# EAGLE design RFID UNIT (EAGLE 9.5.0)
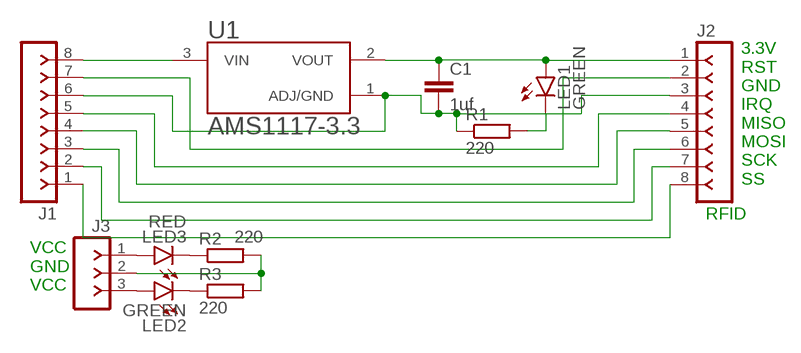
[diagram p0: schematic, sheet 1]

## Parts
C1  1uf  C-EU025-025X050  [C025-025X050]
J1  F-1X08-SIP-100-32Y  [SIP-100-08-32Y]
J2  F-1X08-SIP-100-32Y  [SIP-100-08-32Y]
J3  F-1X03-SIP-100-32Y  [SIP-100-03-32Y]
LED1  GREEN  LEDSML0805  [SML0805]
LED2  GREEN  LED5MM  [LED5MM]
LED3  RED  LED5MM  [LED5MM]
R1  220  R-EU_0204/7  [0204/7]
R2  220  R-EU_0204/7  [0204/7]
R3  220  R-EU_0204/7  [0204/7]
U1  AMS1117-3.3  [SOT229P700X180-4N]

## Nets
N$1: C1.1 J2.1 LED1.A U1.2(VOUT)
N$3: J3.3 LED2.A
N$4: J1.8 U1.3(VIN)
N$5: J1.7 J2.2
N$6: LED3.K(C) R2.1
N$7: LED2.K(C) R3.1
N$8: J1.5 J2.4
N$9: J1.4 J2.5
N$10: J1.3 J2.6
N$11: J1.2 J2.7
N$12: J1.1 J2.8
N$13: J3.1 LED3.A
N$14: C1.2 J1.6 J2.3 R1.1 U1.1(ADJ/GND)
N$15: J3.2 R2.2 R3.2
N$16: LED1.C R1.2

## Notes on the sheet
- 3.3V
  RST
  GND
  IRQ
  MISO
  MOSI
  SCK
  SS
- RFID
- VCC
  GND
  VCC

## Library data of the parts
C1 = rcl:C-EU: CAPACITOR, European symbol; SPICEPREFIX: C
J1 J2 = con-headers-jp:F-1X08-: FEMALE HEADER
J3 = con-headers-jp:F-1X03-: FEMALE HEADER
LED1-LED3 = led:LED: LED OSRAM: - CHIPLED LG R971, LG N971, LY N971, LG Q971, LY Q971, LO R971, LY R971 LH N974, LH R974 LS Q976, LO Q976, LY Q976 LO Q996 - Hyper CHIPLED LW Q18S LB Q993, LB Q99A, LB R99A - SideLED LS A670, LO A670, LY A670, LG A670, LP A670 LB A673, LV A673, LT A673, LW A673 LH A674 LY A675 LS A676, LA A676, LO A676, LY A676, LW A676 LS A679, LY A679, LG A679 - Hyper Micro SIDELED® LS Y876, LA Y876, LO Y876, LY Y876 LT Y87S - SmartLED LW L88C, LW L88S LB L89C, LB L89S, LG L890 LS L89K, LO L89K, LY L89K LS L896, LA L896, LO L896, LY L896 - TOPLED LS T670, LO T670, LY T670, LG T670, LP T670 LSG T670, LSP T670, LSY T670, LOP T670, LYG T670 LG T671, LOG T671, LSG T671 LB T673, LV T673, LT T673, LW T673 LH T674 LS T676, LA T676, LO T676, LY T676, LB T676, LH T676, LSB T676, LW T676 LB T67C, LV T67C, LT T67C, LS T67K, LO T67K, LY T67K, LW E67C LS E67B, LA E67B, LO E67B, LY E67B, LB E67C, LV E67C, LT E67C LW T67C LS T679, LY T679, LG T679 LS T770, LO T770, LY T770, LG T770, LP T770 LB T773, LV T773, LT T773, LW T773 LH T774 LS E675, LA E675, LY E675, LS T675 LS T776, LA T776, LO T776, LY T776, LB T776 LHGB T686 LT T68C, LB T68C - Hyper Mini TOPLED® LB M676 - Mini TOPLED Santana® LG M470 LS M47K, LO M47K, LY M47K Source: http://www.osram.convergy.de LUXEON: - LUMILED® LXK2-PW12-R00, LXK2-PW12-S00, LXK2-PW14-U00, LXK2-PW14-V00 LXK2-PM12-R00, LXK2-PM12-S00, LXK2-PM14-U00 LXK2-PE12-Q00, LXK2-PE12-R00, LXK2-PE12-S00, LXK2-PE14-T00, LXK2-PE14-U00 LXK2-PB12-K00, LXK2-PB12-L00, LXK2-PB12-M00, LXK2-PB14-N00, LXK2-PB14-P00, LXK2-PB14-Q00 LXK2-PR12-L00, LXK2-PR12-M00, LXK2-PR14-Q00, LXK2-PR14-R00 LXK2-PD12-Q00, LXK2-PD12-R00, LXK2-PD12-S00 LXK2-PH12-R00, LXK2-PH12-S00 LXK2-PL12-P00, LXK2-PL12-Q00, LXK2-PL12-R00 Source: www.luxeon.com KINGBRIGHT: KA-3528ASYC Source: www.kingbright.com
R1-R3 = rcl:R-EU_: RESISTOR, European symbol; SPICEPREFIX: R
U1 = AMS1117-3.3:AMS1117-3.3: Sot223/Pkg 1-Amp 3.3-Volt Low Drop Out Voltage Regulatator; AVAILABILITY: Unavailable; DESCRIPTION: Sot-89; MF: Advanced Monolithic Systems; MP: AMS1117-3.3; PACKAGE: SOT-89 ams; PRICE: None

## Board
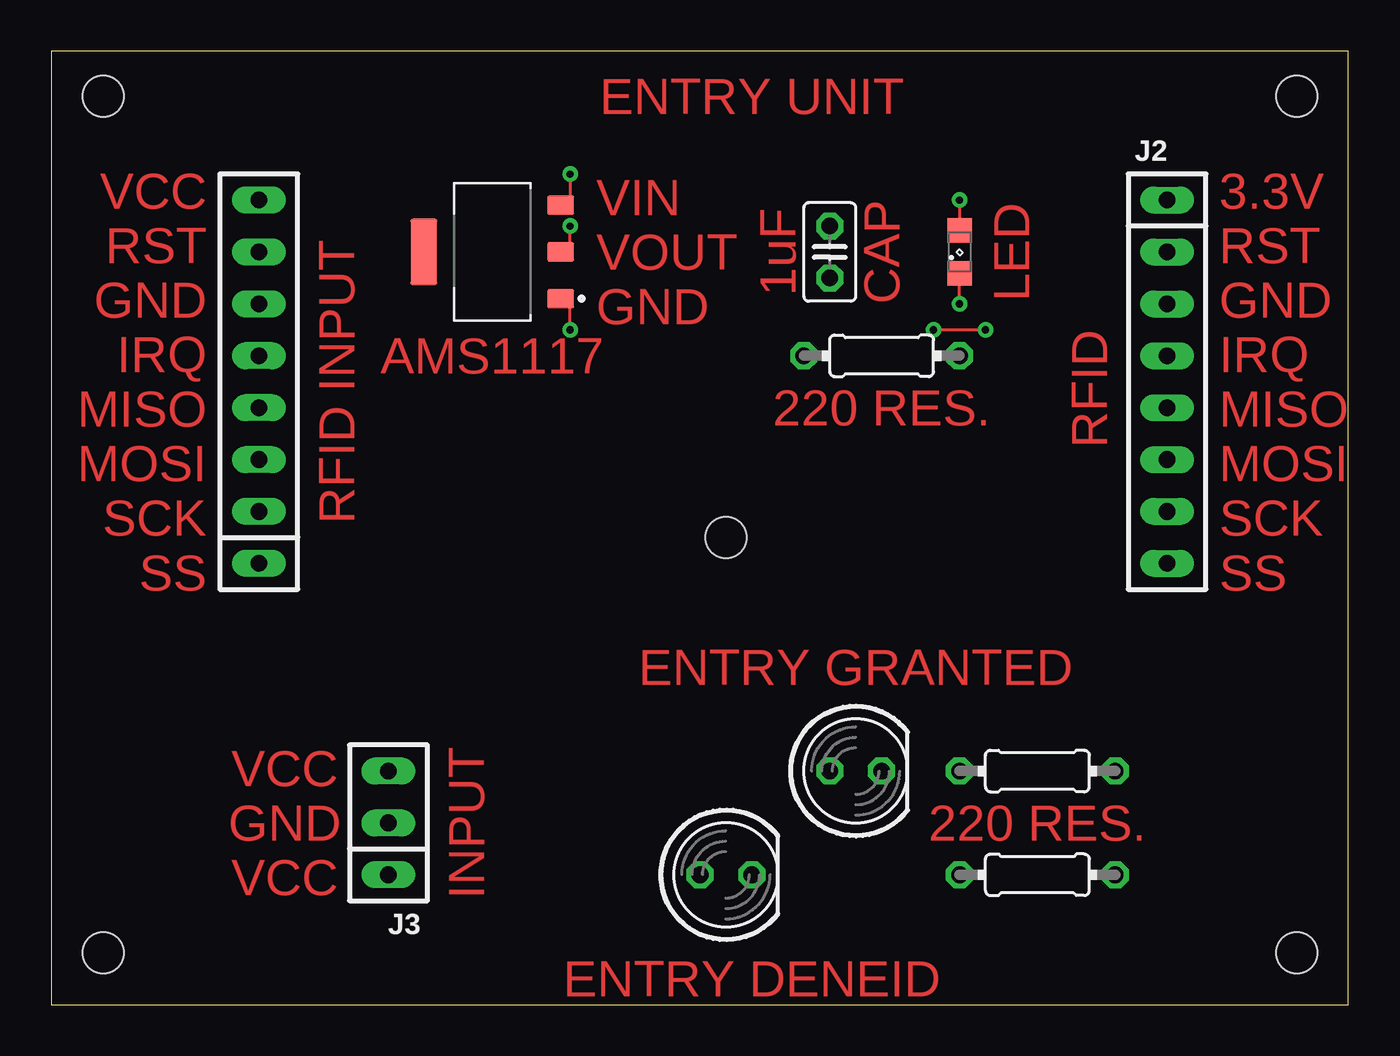
[diagram p1: board, top side]
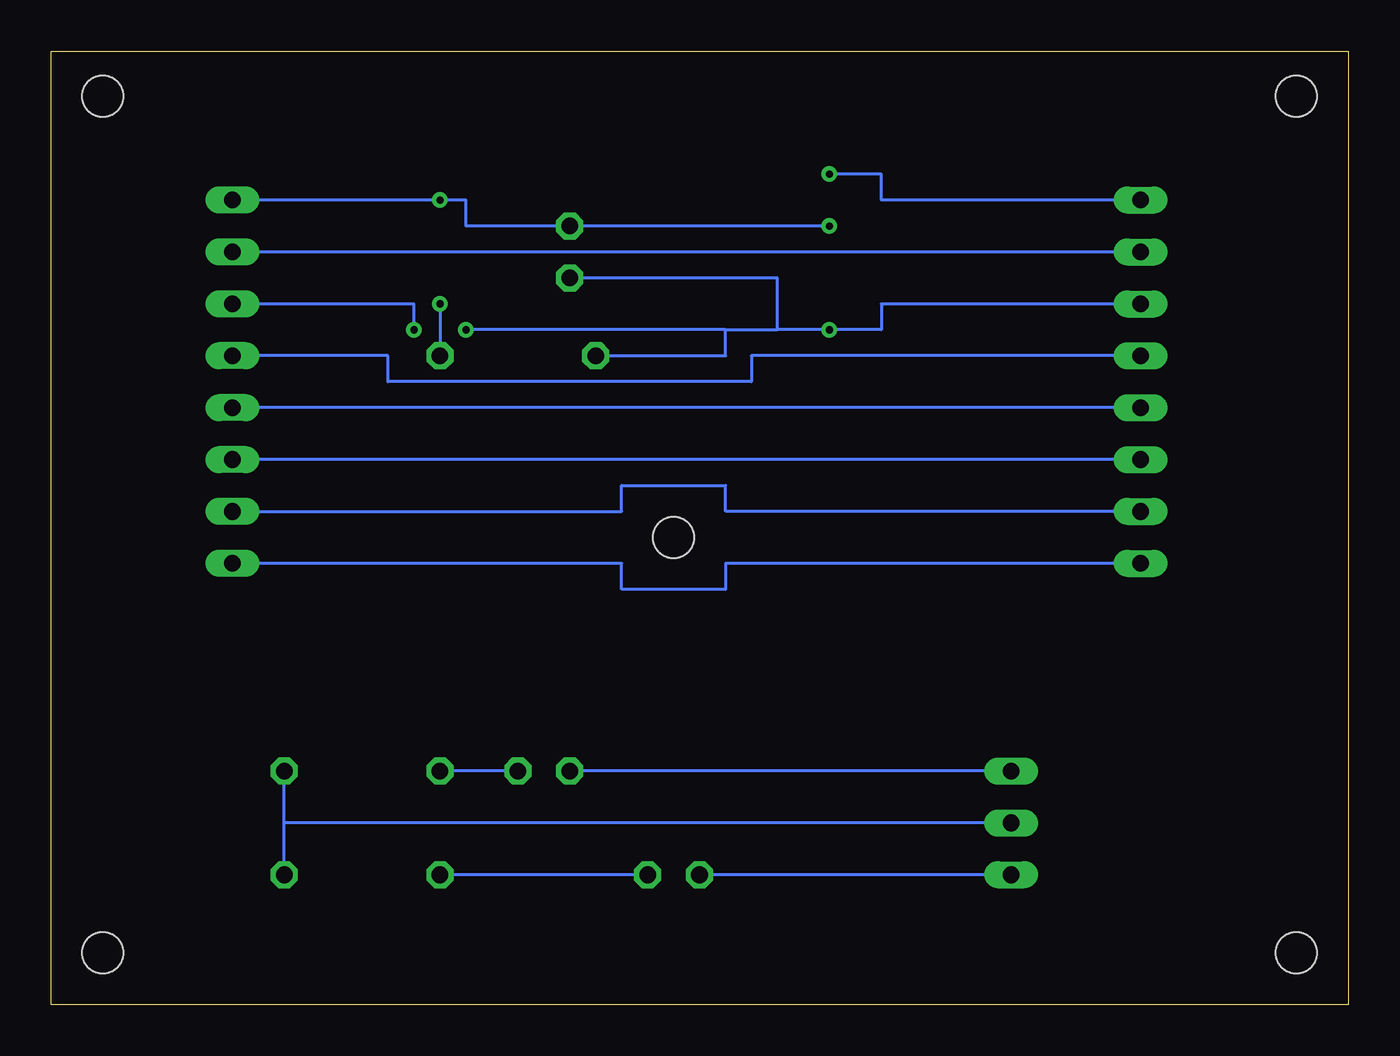
[diagram p2: board, bottom side, seen from below]

Size 63.48 x 46.66 mm. Coordinates in mm from the lower left corner, seen from the top.
Outline: 0,0 63.48,0 63.48,46.66 0,46.66 0,0
Copper layers (1*16): Top 0.035mm / dielectric 1.5mm / Bottom 0.035mm
Design rules "default": minimum track width 6mil, minimum drill 0.35mm, track to track 6mil, track to pad 6mil, pad to pad 6mil, via to via 6mil, smd to smd 6mil, copper to edge 40mil, drill to drill 6mil, minimum pad ring 10mil, minimum via ring 8mil, stop-mask expansion 4mil, vias tented up to drill 0mil, thermal gap 10mil
Holes 2 mm at 2.54,2.54 60.96,2.54 60.96,44.45 2.54,44.45 33.02,22.86

### Footprints (pad centres in the part's own frame; a part is rotated, then mirrored left to right if it is on the bottom)
C025-025X050 = drill 0.813 octagon: 1 -1.27,0; 2 1.27,0
SIP-100-08-32Y = drill 0.813 long: 1 -8.89,0; 2 -6.35,0; 3 -3.81,0; 4 -1.27,0; 5 1.27,0; 6 3.81,0; 7 6.35,0; 8 8.89,0
SIP-100-03-32Y = drill 0.813 long: 1 -2.54,0; 2 0,0; 3 2.54,0
SML0805 = smd 1.2 x 1.2: A 1.05,0; C -1.05,0
LED5MM = drill 0.813 octagon: A -1.27,0; K 1.27,0
0204/7 = drill 0.813 octagon: 1 -3.81,0; 2 3.81,0
SOT229P700X180-4N = smd 0.93 x 1.31: 1 -2.29,-3.345; 2 0,-3.345; 3 2.29,-3.345 | smd 3.24 x 1.31: 4 0,3.345

### Placement (x,y rotation side)
C1  38.1,36.83 270 top
J1  10.16,30.48 90 top
J2  54.61,30.48 270 top
J3  16.51,8.89 90 top
LED1  44.45,36.83 90 top
LED2  39.37,11.43 0 top
LED3  33.02,6.35 0 top
R1  40.64,31.75 0 top
R2  48.26,6.35 0 top
R3  48.26,11.43 0 top
U1  21.59,36.83 90 top

### Tracks (layer width: path | path; a pad name or v marks a point on that pad's centre or on a via)
N$1  (via drill 0.35)
  Top 0.152: U1.2 25.4,37.3 v25.4,38.1 | 44.45,38.1 LED1.A v44.45,39.37
  Bottom 0.152: v25.4,38.1 C1.1 43.18,38.1 43.18,39.37 v44.45,39.37 J2.1
N$3
  Bottom 0.152: J3.3 LED2.A
N$4  (via drill 0.35)
  Top 0.152: v25.4,40.64 25.4,39.37 25.15,39.12 U1.3
  Bottom 0.152: J1.8 22.86,39.37 22.86,40.64 v25.4,40.64
N$5
  Bottom 0.152: J1.7 J2.2
N$6
  Bottom 0.152: LED3.K R2.1
N$7
  Bottom 0.152: LED2.K R3.1
N$8
  Bottom 0.152: J1.5 29.21,31.75 29.21,30.48 46.99,30.48 46.99,31.75 J2.4
N$9
  Bottom 0.152: J1.4 J2.5
N$10
  Bottom 0.152: J1.3 J2.6
N$11
  Bottom 0.152: J1.2 30.48,24.13 30.48,25.4 35.56,25.4 35.56,24.13 J2.7
N$12
  Bottom 0.152: J1.1 30.48,21.59 30.48,20.32 35.56,20.32 35.56,21.59 36.83,21.59 J2.8
N$13
  Bottom 0.152: J3.1 LED3.A
N$14  (via drill 0.35)
  Top 0.152: v25.4,33.02 25.4,34.29 25.15,34.54 U1.1 | v43.18,33.02 v45.72,33.02
  Bottom 0.152: J1.6 22.86,34.29 22.86,33.02 v25.4,33.02 27.94,33.02 | 27.94,33.02 27.94,35.56 C1.2 | R1.1 30.48,31.75 30.48,33.02 | 30.48,33.02 27.94,33.02 | 30.48,33.02 v43.18,33.02 | v45.72,33.02 45.72,34.29 J2.3
N$15
  Bottom 0.152: J3.2 52.07,8.89 | 52.07,8.89 R3.2 | R2.2 52.07,8.89
N$16  (via drill 0.35)
  Top 0.152: v44.45,34.29 LED1.C
  Bottom 0.152: v44.45,34.29 R1.2

### Text on the board
Top: ENTRY UNIT | VIN / VOUT / GND | 1uF | CAP | LED | AMS1117 | VCC / RST / GND / IRQ / MISO / MOSI / SCK / SS | RFID INPUT | RFID | 3.3V / RST / GND / IRQ / MISO / MOSI / SCK / SS | 220 RES. | ENTRY GRANTED | VCC / GND / VCC | INPUT | 220 RES. | ENTRY DENEID